# EAGLE design Nixie Test - backup (EAGLE 6.5.0)

## Sheet 1 of 12
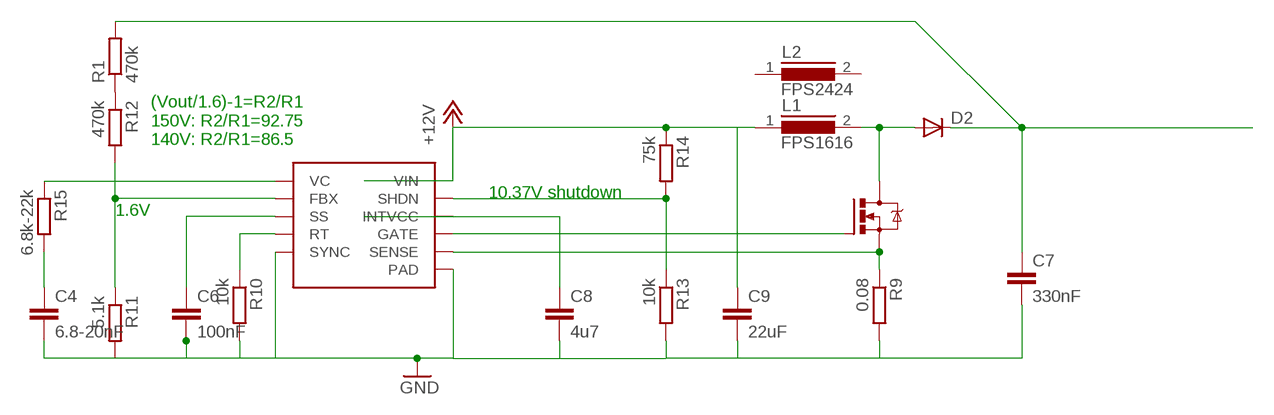
[diagram p0: schematic, sheet 1]

### Parts
C4  6.8-20nF  C-EUC0805K  [C0805K]
C6  100nF  C-EUC0805K  [C0805K]
C7  330nF  C-EUC1812  [C1812]
C8  4u7  C-EUC1206K  [C1206K]
C9  22uF  C-EUC1210K  [C1210K]
D2  DIODE-DO219AB  [DO219AB]
L1  FPS1616  [1616FPS_22UH]
L2  FPS2424  [242408FPS_22UH]
Q1  N-MOSFET-TO252-DPAK  [TO252]
R1  470k  R-EU_R0805  [R0805]
R9  0.08  R-EU_R0805  [R0805]
R10  10k  R-EU_R0805  [R0805]
R11  5.1k  R-EU_R0805  [R0805]
R12  470k  R-EU_R0805  [R0805]
R13  10k  R-EU_R0805  [R0805]
R14  75k  R-EU_R0805  [R0805]
R15  6.8k-22k  R-EU_R0805  [R0805]
U2  LT3757MSOP-10  [MSOP-10]

### Nets
+12V: C9.1 L1.1 R14.1 U2.10(VIN) ; also sheet 2,3,4,5,6,7,8,9,10,11,12
GND: C4.2 C6.2 C7.2 C8.2 C9.2 R9.2 R10.2 R11.2 R13.2 U2.5(SYNC) U2.PAD ; also sheet 2,3,4,5,6,7,8,9,10,11,12
N$1: R1.1 R12.1
N$19: Q1.1(G) U2.7(GATE)
N$20: R11.1 R12.2 U2.2(FBX)
N$21: D2.A L1.2 Q1.3(D)
N$22: C7.1 D2.C R1.2
N$23: C6.1 U2.3(SS)
N$24: R10.1 U2.4(RT)
N$25: Q1.2(S) R9.1 U2.6(SENSE)
N$26: R13.1 R14.2 U2.9(SHDN)
N$27: C4.1 R15.2
N$28: R15.1 U2.1(VC)
N$29: C8.1 U2.8(INTVCC)
Unconnected: L2.1 L2.2

### Notes on the sheet
- (Vout/1.6)-1=R2/R1
  150V: R2/R1=92.75
  140V: R2/R1=86.5
- 10.37V shutdown
- 1.6V

## Sheet 2 of 12
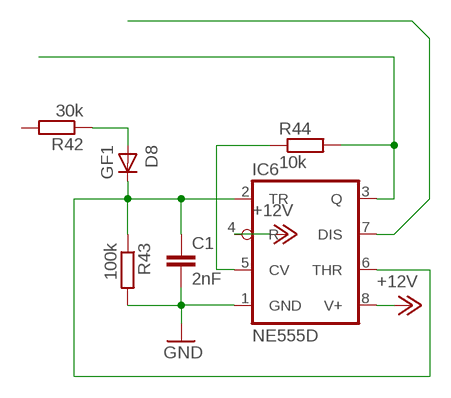
[diagram p1: schematic, sheet 2]

### Parts
C1  2nF  C-EUC1206K  [C1206K]
D8  GF1  [SMA-DO214AC]
IC6  NE555D  [SO08]
R42  30k  R-EU_R0805  [R0805]
R43  100k  R-EU_R0805  [R0805]
R44  10k  R-EU_R0805  [R0805]

### Nets
+12V: IC6.4(R) IC6.8(V+) ; also sheet 1,3,4,5,6,7,8,9,10,11,12
GND: C1.2 IC6.1(GND) R43.2 ; also sheet 1,3,4,5,6,7,8,9,10,11,12
N$2: IC6.7(DIS)
N$84: D8.A R42.1
N$85: IC6.3(Q) R44.2
N$86: IC6.5(CV) R44.1
N$90: C1.1 D8.K(C) IC6.2(TR) IC6.6(THR) R43.1
Unconnected: R42.2

## Sheet 3 of 12
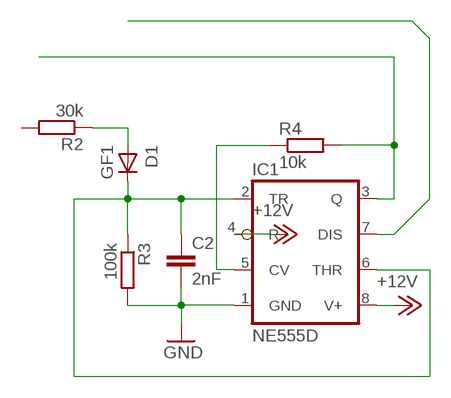
[diagram p2: schematic, sheet 3]

### Parts
C2  2nF  C-EUC1206K  [C1206K]
D1  GF1  [SMA-DO214AC]
IC1  NE555D  [SO08]
R2  30k  R-EU_R0805  [R0805]
R3  100k  R-EU_R0805  [R0805]
R4  10k  R-EU_R0805  [R0805]

### Nets
+12V: IC1.4(R) IC1.8(V+) ; also sheet 1,2,4,5,6,7,8,9,10,11,12
GND: C2.2 IC1.1(GND) R3.2 ; also sheet 1,2,4,5,6,7,8,9,10,11,12
N$10: D1.A R2.1
N$11: IC1.5(CV) R4.1
N$12: C2.1 D1.K(C) IC1.2(TR) IC1.6(THR) R3.1
N$13: IC1.3(Q) R4.2
N$14: IC1.7(DIS)
Unconnected: R2.2

## Sheet 4 of 12
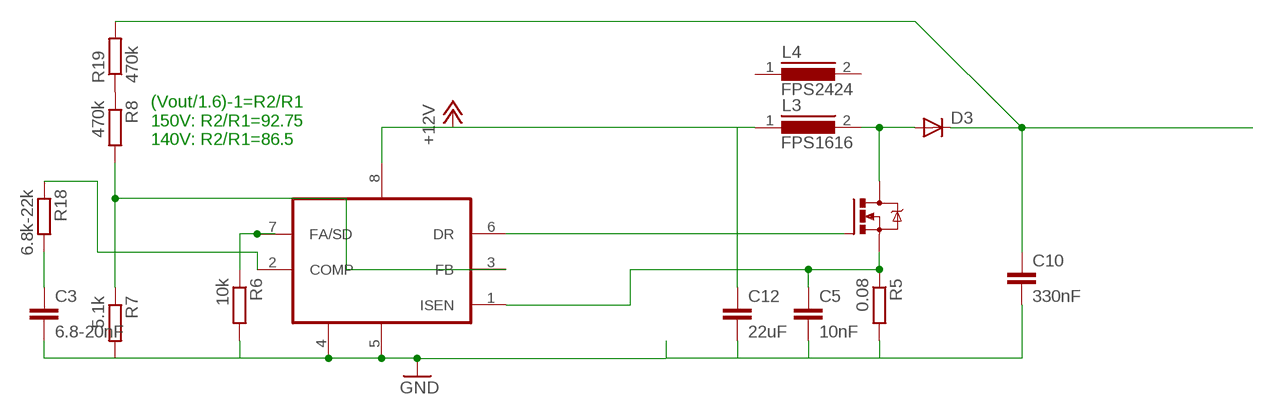
[diagram p3: schematic, sheet 4]

### Parts
C3  6.8-20nF  C-EUC0805K  [C0805K]
C5  10nF  C-EUC0805K  [C0805K]
C10  330nF  C-EUC1812  [C1812]
C12  22uF  C-EUC1210K  [C1210K]
D3  DIODE-DO219AB  [DO219AB]
L3  FPS1616  [1616FPS_22UH]
L4  FPS2424  [242408FPS_22UH]
Q2  N-MOSFET-TO252-DPAK  [TO252]
R5  0.08  R-EU_R0805  [R0805]
R6  10k  R-EU_R0805  [R0805]
R7  5.1k  R-EU_R0805  [R0805]
R8  470k  R-EU_R0805  [R0805]
R18  6.8k-22k  R-EU_R0805  [R0805]
R19  470k  R-EU_R0805  [R0805]
U3  LM3478  [MSOP08]

### Nets
+12V: C12.1 L3.1 U3.8(VIN) ; also sheet 1,2,3,5,6,7,8,9,10,11,12
GND: C3.2 C5.2 C10.2 C12.2 R5.2 R6.2 R7.2 U3.4(AGND) U3.5(PGND) ; also sheet 1,2,3,5,6,7,8,9,10,11,12
N$33: Q2.1(G) U3.6(DR)
N$34: R7.1 R8.2 U3.3(FB)
N$35: D3.A L3.2 Q2.3(D)
N$36: C10.1 D3.C R19.2
N$37: R18.1 U3.2(COMP)
N$38: R6.1 U3.7(FA/SD)
N$39: C5.1 Q2.2(S) R5.1 U3.1(ISEN)
N$41: C3.1 R18.2
N$44: R8.1 R19.1
Unconnected: L4.1 L4.2

### Notes on the sheet
- (Vout/1.6)-1=R2/R1
  150V: R2/R1=92.75
  140V: R2/R1=86.5

## Sheet 5 of 12
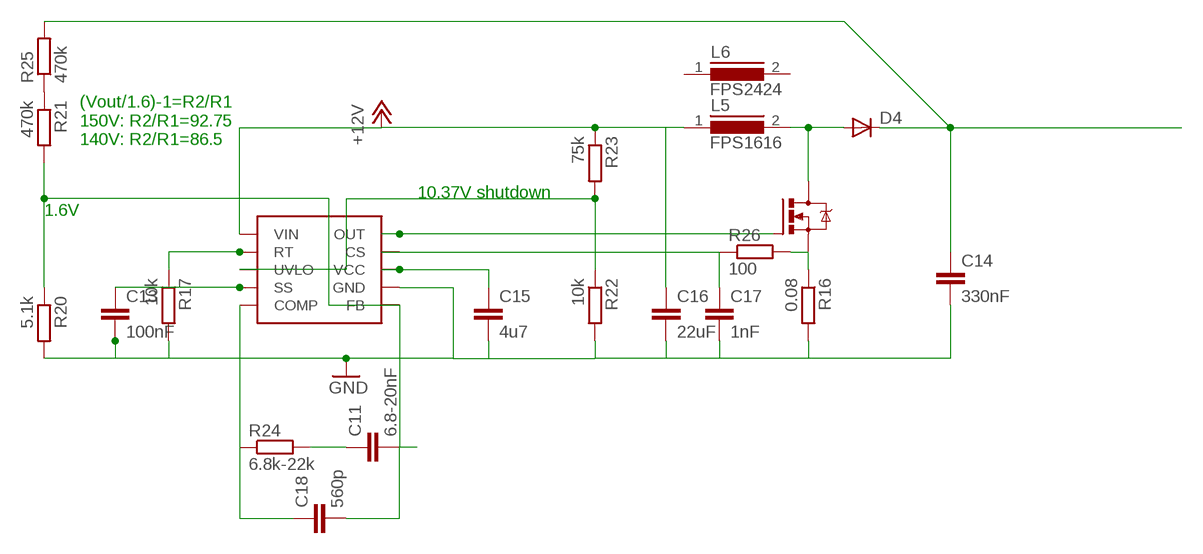
[diagram p4: schematic, sheet 5]

### Parts
C11  6.8-20nF  C-EUC0805K  [C0805K]
C13  100nF  C-EUC0805K  [C0805K]
C14  330nF  C-EUC1812  [C1812]
C15  4u7  C-EUC1206K  [C1206K]
C16  22uF  C-EUC1210K  [C1210K]
C17  1nF  C-EUC0805K  [C0805K]
C18  560p  C-EUC0805K  [C0805K]
D4  DIODE-DO219AB  [DO219AB]
L5  FPS1616  [1616FPS_22UH]
L6  FPS2424  [242408FPS_22UH]
Q3  N-MOSFET-TO252-DPAK  [TO252]
R16  0.08  R-EU_R0805  [R0805]
R17  10k  R-EU_R0805  [R0805]
R20  5.1k  R-EU_R0805  [R0805]
R21  470k  R-EU_R0805  [R0805]
R22  10k  R-EU_R0805  [R0805]
R23  75k  R-EU_R0805  [R0805]
R24  6.8k-22k  R-EU_R0805  [R0805]
R25  470k  R-EU_R0805  [R0805]
R26  100  R-EU_R0805  [R0805]
U4  LM5022MSOP-10  [MSOP-10-NOPAD]

### Nets
+12V: C16.1 L5.1 R23.1 U4.1(VIN) ; also sheet 1,2,3,4,6,7,8,9,10,11,12
GND: C13.2 C14.2 C15.2 C16.2 C17.2 R16.2 R17.2 R20.2 R22.2 U4.6(GND) ; also sheet 1,2,3,4,6,7,8,9,10,11,12
N$42: Q3.1(G) U4.5(OUT)
N$43: C11.2 C18.2 R20.1 R21.2 U4.2(FB)
N$45: D4.A L5.2 Q3.3(D)
N$46: C14.1 D4.C R25.2
N$47: C13.1 U4.10(SS)
N$48: R17.1 U4.9(RT)
N$49: Q3.2(S) R16.1 R26.2
N$50: R22.1 R23.2 U4.7(UVLO)
N$51: C11.1 R24.2
N$52: C18.1 R24.1 U4.3(COMP)
N$53: C15.1 U4.4(VCC)
N$54: R21.1 R25.1
N$55: C17.1 R26.1 U4.8(CS)
Unconnected: L6.1 L6.2

### Notes on the sheet
- (Vout/1.6)-1=R2/R1
  150V: R2/R1=92.75
  140V: R2/R1=86.5
- 10.37V shutdown
- 1.6V

## Sheet 6 of 12
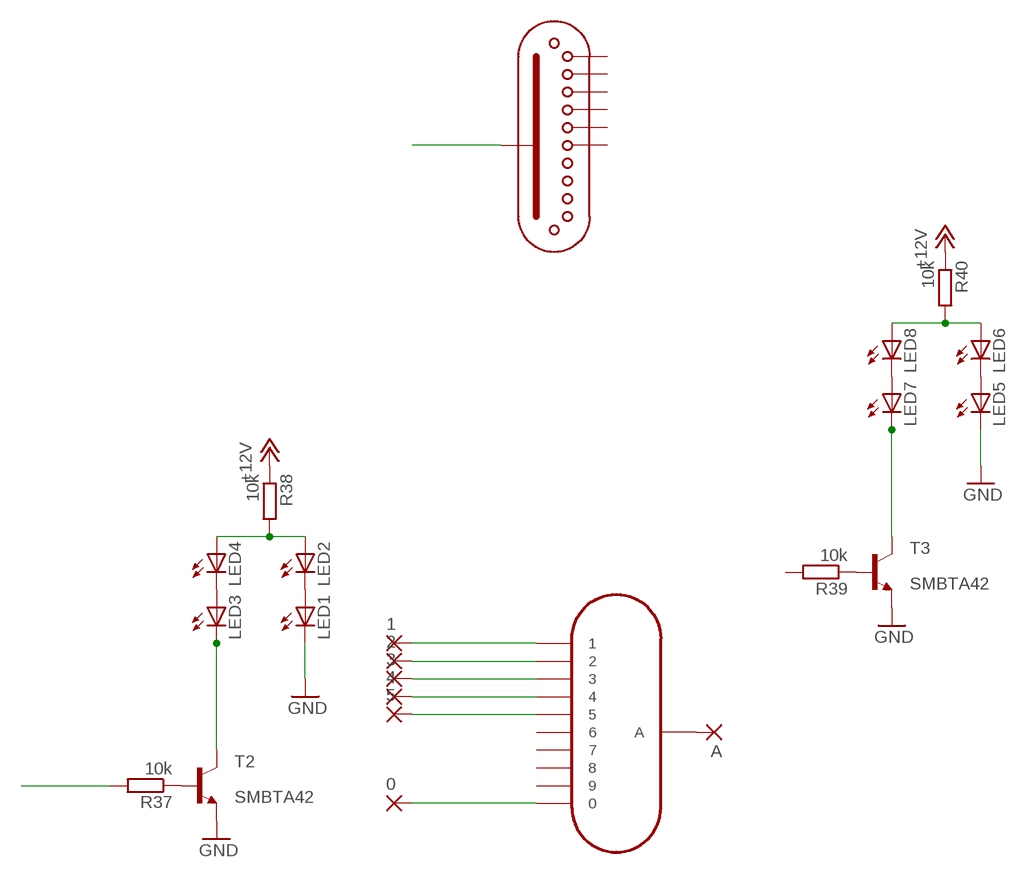
[diagram p5: schematic, sheet 6]

### Parts
0  SMD2  [SMD1,27-2,54]
1  SMD2  [SMD1,27-2,54]
2  SMD2  [SMD1,27-2,54]
3  SMD2  [SMD1,27-2,54]
4  SMD2  [SMD1,27-2,54]
5  SMD2  [SMD1,27-2,54]
A  SMD2  [SMD1,27-2,54]
LED1  LED3MM  [LED3MM]
LED2  LED3MM  [LED3MM]
LED3  LED3MM  [LED3MM]
LED4  LED3MM  [LED3MM]
LED5  LED3MM  [LED3MM]
LED6  LED3MM  [LED3MM]
LED7  LED3MM  [LED3MM]
LED8  LED3MM  [LED3MM]
N1  IN-12A-IN-12  [IN-12]
R37  10k  R-EU_R0805  [R0805]
R38  10k  R-EU_R0805  [R0805]
R39  10k  R-EU_R0805  [R0805]
R40  10k  R-EU_R0805  [R0805]
T2  MMBTA42LT1-NPN-SOT23-BEC  [SOT23-BEC]
T3  MMBTA42LT1-NPN-SOT23-BEC  [SOT23-BEC]
U$3  ZM1020  [ZM1020]

### Nets
+12V: R38.1 R40.1 ; also sheet 1,2,3,4,5,7,8,9,10,11,12
GND: LED1.K(C) LED5.K(C) T2.E T3.E ; also sheet 1,2,3,4,5,7,8,9,10,11,12
N$60: R37.2
N$91: LED1.A LED2.K(C)
N$92: LED3.A LED4.K(C)
N$93: R37.1 T2.B
N$94: LED3.K(C) T2.C
N$95: LED2.A LED4.A R38.2
N$96: U$3.12(A)
N$97: 0.1(P) N1.0
N$98: 1.1(P) N1.1
N$99: 2.1(P) N1.2
N$100: 3.1(P) N1.3
N$101: 4.1(P) N1.4
N$102: 5.1(P) N1.5
N$103: A.1(P) N1.A
N$104: LED5.A LED6.K(C)
N$105: LED7.A LED8.K(C)
N$106: R39.1 T3.B
N$107: LED7.K(C) T3.C
N$108: LED6.A LED8.A R40.2
Unconnected: N1.6 N1.7 N1.8 N1.9 R39.2 U$3.1 U$3.2 U$3.3 U$3.4 U$3.5 U$3.11

## Sheet 7 of 12
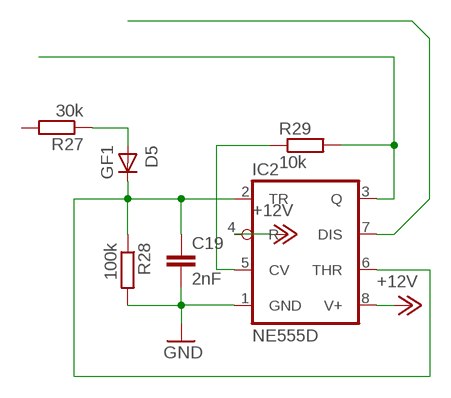
[diagram p6: schematic, sheet 7]

### Parts
C19  2nF  C-EUC1206K  [C1206K]
D5  GF1  [SMA-DO214AC]
IC2  NE555D  [SO08]
R27  30k  R-EU_R0805  [R0805]
R28  100k  R-EU_R0805  [R0805]
R29  10k  R-EU_R0805  [R0805]

### Nets
+12V: IC2.4(R) IC2.8(V+) ; also sheet 1,2,3,4,5,6,8,9,10,11,12
GND: C19.2 IC2.1(GND) R28.2 ; also sheet 1,2,3,4,5,6,8,9,10,11,12
N$58: D5.A R27.1
N$59: IC2.5(CV) R29.1
N$61: C19.1 D5.K(C) IC2.2(TR) IC2.6(THR) R28.1
N$62: IC2.3(Q) R29.2
N$63: IC2.7(DIS)
Unconnected: R27.2

## Sheet 8 of 12
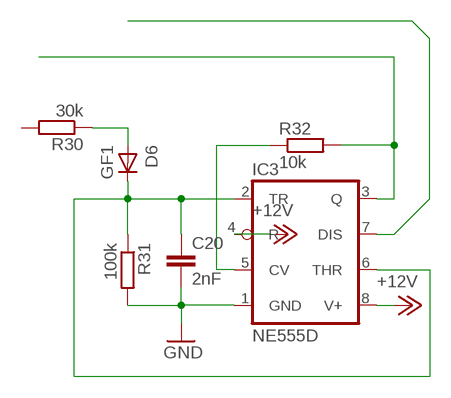
[diagram p7: schematic, sheet 8]

### Parts
C20  2nF  C-EUC1206K  [C1206K]
D6  GF1  [SMA-DO214AC]
IC3  NE555D  [SO08]
R30  30k  R-EU_R0805  [R0805]
R31  100k  R-EU_R0805  [R0805]
R32  10k  R-EU_R0805  [R0805]

### Nets
+12V: IC3.4(R) IC3.8(V+) ; also sheet 1,2,3,4,5,6,7,9,10,11,12
GND: C20.2 IC3.1(GND) R31.2 ; also sheet 1,2,3,4,5,6,7,9,10,11,12
N$71: D6.A R30.1
N$72: IC3.5(CV) R32.1
N$73: C20.1 D6.K(C) IC3.2(TR) IC3.6(THR) R31.1
N$75: IC3.3(Q) R32.2
N$76: IC3.7(DIS)
Unconnected: R30.2

## Sheet 9 of 12
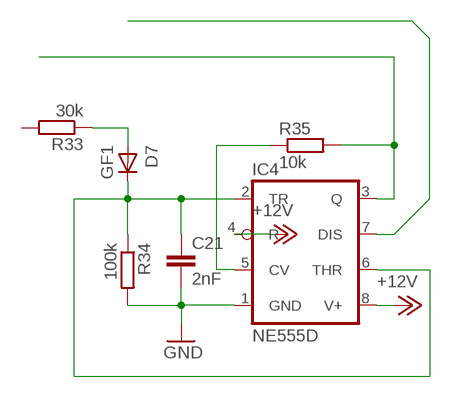
[diagram p8: schematic, sheet 9]

### Parts
C21  2nF  C-EUC1206K  [C1206K]
D7  GF1  [SMA-DO214AC]
IC4  NE555D  [SO08]
R33  30k  R-EU_R0805  [R0805]
R34  100k  R-EU_R0805  [R0805]
R35  10k  R-EU_R0805  [R0805]

### Nets
+12V: IC4.4(R) IC4.8(V+) ; also sheet 1,2,3,4,5,6,7,8,10,11,12
GND: C21.2 IC4.1(GND) R34.2 ; also sheet 1,2,3,4,5,6,7,8,10,11,12
N$87: D7.A R33.1
N$88: IC4.5(CV) R35.1
N$89: C21.1 D7.K(C) IC4.2(TR) IC4.6(THR) R34.1
N$123: IC4.3(Q) R35.2
N$124: IC4.7(DIS)
Unconnected: R33.2

## Sheet 10 of 12
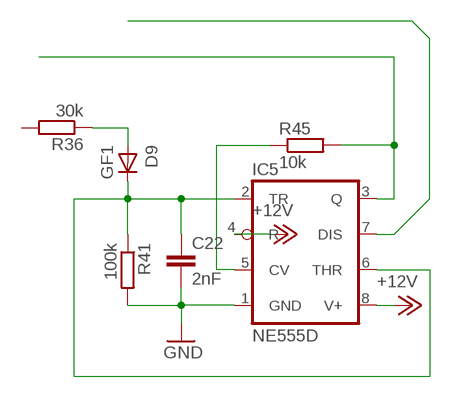
[diagram p9: schematic, sheet 10]

### Parts
C22  2nF  C-EUC1206K  [C1206K]
D9  GF1  [SMA-DO214AC]
IC5  NE555D  [SO08]
R36  30k  R-EU_R0805  [R0805]
R41  100k  R-EU_R0805  [R0805]
R45  10k  R-EU_R0805  [R0805]

### Nets
+12V: IC5.4(R) IC5.8(V+) ; also sheet 1,2,3,4,5,6,7,8,9,11,12
GND: C22.2 IC5.1(GND) R41.2 ; also sheet 1,2,3,4,5,6,7,8,9,11,12
N$132: D9.A R36.1
N$133: IC5.5(CV) R45.1
N$134: C22.1 D9.K(C) IC5.2(TR) IC5.6(THR) R41.1
N$135: IC5.3(Q) R45.2
N$136: IC5.7(DIS)
Unconnected: R36.2

## Sheet 11 of 12
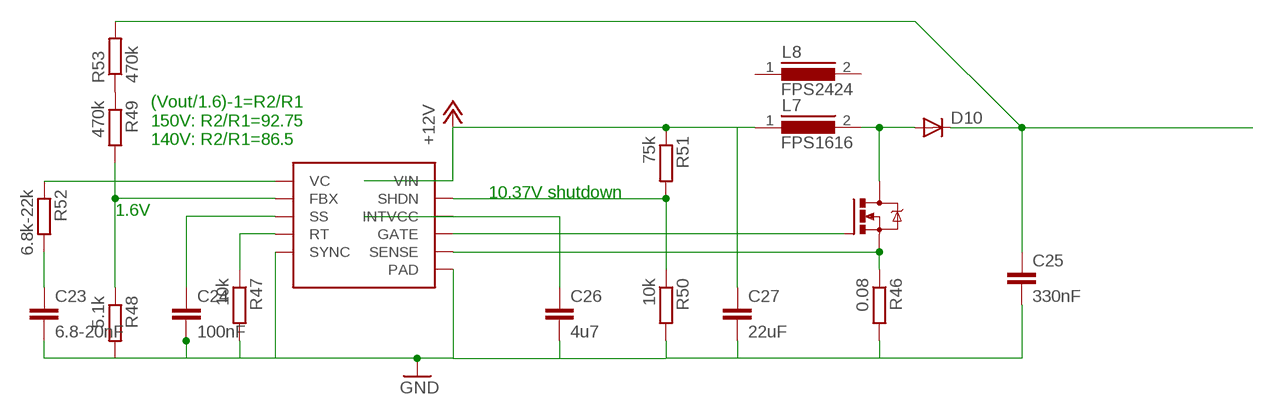
[diagram p10: schematic, sheet 11]

### Parts
C23  6.8-20nF  C-EUC0805K  [C0805K]
C24  100nF  C-EUC0805K  [C0805K]
C25  330nF  C-EUC1812  [C1812]
C26  4u7  C-EUC1206K  [C1206K]
C27  22uF  C-EUC1210K  [C1210K]
D10  DIODE-DO219AB  [DO219AB]
L7  FPS1616  [1616FPS_22UH]
L8  FPS2424  [242408FPS_22UH]
Q4  N-MOSFET-TO252-DPAK  [TO252]
R46  0.08  R-EU_R0805  [R0805]
R47  10k  R-EU_R0805  [R0805]
R48  5.1k  R-EU_R0805  [R0805]
R49  470k  R-EU_R0805  [R0805]
R50  10k  R-EU_R0805  [R0805]
R51  75k  R-EU_R0805  [R0805]
R52  6.8k-22k  R-EU_R0805  [R0805]
R53  470k  R-EU_R0805  [R0805]
U1  LT3757MSOP-10  [MSOP-10]

### Nets
+12V: C27.1 L7.1 R51.1 U1.10(VIN) ; also sheet 1,2,3,4,5,6,7,8,9,10,12
GND: C23.2 C24.2 C25.2 C26.2 C27.2 R46.2 R47.2 R48.2 R50.2 U1.5(SYNC) U1.PAD ; also sheet 1,2,3,4,5,6,7,8,9,10,12
N$144: Q4.1(G) U1.7(GATE)
N$145: R48.1 R49.2 U1.2(FBX)
N$146: D10.A L7.2 Q4.3(D)
N$147: C25.1 D10.C R53.2
N$148: C24.1 U1.3(SS)
N$149: R47.1 U1.4(RT)
N$150: Q4.2(S) R46.1 U1.6(SENSE)
N$151: R50.1 R51.2 U1.9(SHDN)
N$152: C23.1 R52.2
N$153: R52.1 U1.1(VC)
N$154: C26.1 U1.8(INTVCC)
N$155: R49.1 R53.1
Unconnected: L8.1 L8.2

### Notes on the sheet
- (Vout/1.6)-1=R2/R1
  150V: R2/R1=92.75
  140V: R2/R1=86.5
- 10.37V shutdown
- 1.6V

## Sheet 12 of 12
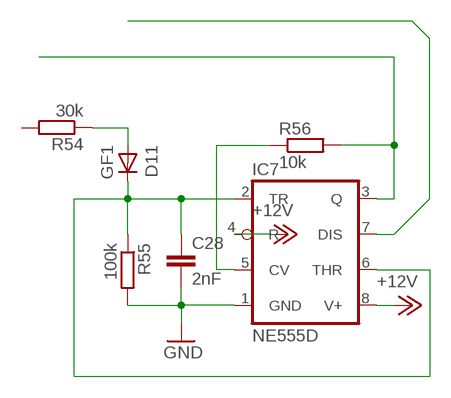
[diagram p11: schematic, sheet 12]

### Parts
C28  2nF  C-EUC1206K  [C1206K]
D11  GF1  [SMA-DO214AC]
IC7  NE555D  [SO08]
R54  30k  R-EU_R0805  [R0805]
R55  100k  R-EU_R0805  [R0805]
R56  10k  R-EU_R0805  [R0805]

### Nets
+12V: IC7.4(R) IC7.8(V+) ; also sheet 1,2,3,4,5,6,7,8,9,10,11
GND: C28.2 IC7.1(GND) R55.2 ; also sheet 1,2,3,4,5,6,7,8,9,10,11
N$159: D11.A R54.1
N$160: IC7.5(CV) R56.1
N$161: C28.1 D11.K(C) IC7.2(TR) IC7.6(THR) R55.1
N$162: IC7.3(Q) R56.2
N$163: IC7.7(DIS)
Unconnected: R54.2

## Library data of the parts
0 1-5 A = wirepad:SMD2: SMD PAD
C1-C28 = rcl:C-EU: CAPACITOR, European symbol
D1 D5-D9 D11 = diode:GF1: DIODE
D2-D4 D10 = diode_extended:DIODE-: DIODE
IC1-IC7 = linear:*555: TIMER
L1-L8 = inductor_power:FPS: High Power Density, High Efficiency, Shielded Inductors Source: coiltronics_dr_series.pdf
LED1-LED8 = led:LED: LED OSRAM: - CHIPLED LG R971, LG N971, LY N971, LG Q971, LY Q971, LO R971, LY R971 LH N974, LH R974 LS Q976, LO Q976, LY Q976 LO Q996 - Hyper CHIPLED LW Q18S LB Q993, LB Q99A, LB R99A - SideLED LS A670, LO A670, LY A670, LG A670, LP A670 LB A673, LV A673, LT A673, LW A673 LH A674 LY A675 LS A676, LA A676, LO A676, LY A676, LW A676 LS A679, LY A679, LG A679 - Hyper Micro SIDELED® LS Y876, LA Y876, LO Y876, LY Y876 LT Y87S - SmartLED LW L88C, LW L88S LB L89C, LB L89S, LG L890 LS L89K, LO L89K, LY L89K LS L896, LA L896, LO L896, LY L896 - TOPLED LS T670, LO T670, LY T670, LG T670, LP T670 LSG T670, LSP T670, LSY T670, LOP T670, LYG T670 LG T671, LOG T671, LSG T671 LB T673, LV T673, LT T673, LW T673 LH T674 LS T676, LA T676, LO T676, LY T676, LB T676, LH T676, LSB T676, LW T676 LB T67C, LV T67C, LT T67C, LS T67K, LO T67K, LY T67K, LW E67C LS E67B, LA E67B, LO E67B, LY E67B, LB E67C, LV E67C, LT E67C LW T67C LS T679, LY T679, LG T679 LS T770, LO T770, LY T770, LG T770, LP T770 LB T773, LV T773, LT T773, LW T773 LH T774 LS E675, LA E675, LY E675, LS T675 LS T776, LA T776, LO T776, LY T776, LB T776 LHGB T686 LT T68C, LB T68C - Hyper Mini TOPLED® LB M676 - Mini TOPLED Santana® LG M470 LS M47K, LO M47K, LY M47K Source: http://www.osram.convergy.de LUXEON: - LUMILED® LXK2-PW12-R00, LXK2-PW12-S00, LXK2-PW14-U00, LXK2-PW14-V00 LXK2-PM12-R00, LXK2-PM12-S00, LXK2-PM14-U00 LXK2-PE12-Q00, LXK2-PE12-R00, LXK2-PE12-S00, LXK2-PE14-T00, LXK2-PE14-U00 LXK2-PB12-K00, LXK2-PB12-L00, LXK2-PB12-M00, LXK2-PB14-N00, LXK2-PB14-P00, LXK2-PB14-Q00 LXK2-PR12-L00, LXK2-PR12-M00, LXK2-PR14-Q00, LXK2-PR14-R00 LXK2-PD12-Q00, LXK2-PD12-R00, LXK2-PD12-S00 LXK2-PH12-R00, LXK2-PH12-S00 LXK2-PL12-P00, LXK2-PL12-Q00, LXK2-PL12-R00 Source: www.luxeon.com KINGBRIGHT: KA-3528ASYC Source: www.kingbright.com
N1 = IN-12A:IN-12A
Q1-Q4 = N-MOSFET:N-MOSFET
R1-R56 = rcl:R-EU_: RESISTOR, European symbol
T2 T3 = transistor:*-NPN-: NPN Transistror BF959 corrected 2008.03.06; T: SMBTA42
U1 U2 = LT3757:LT3757
U3 = LM3478:LM3478
U4 = LM5022:LM5022
U$3 = ZM1020:ZM1020

## Board
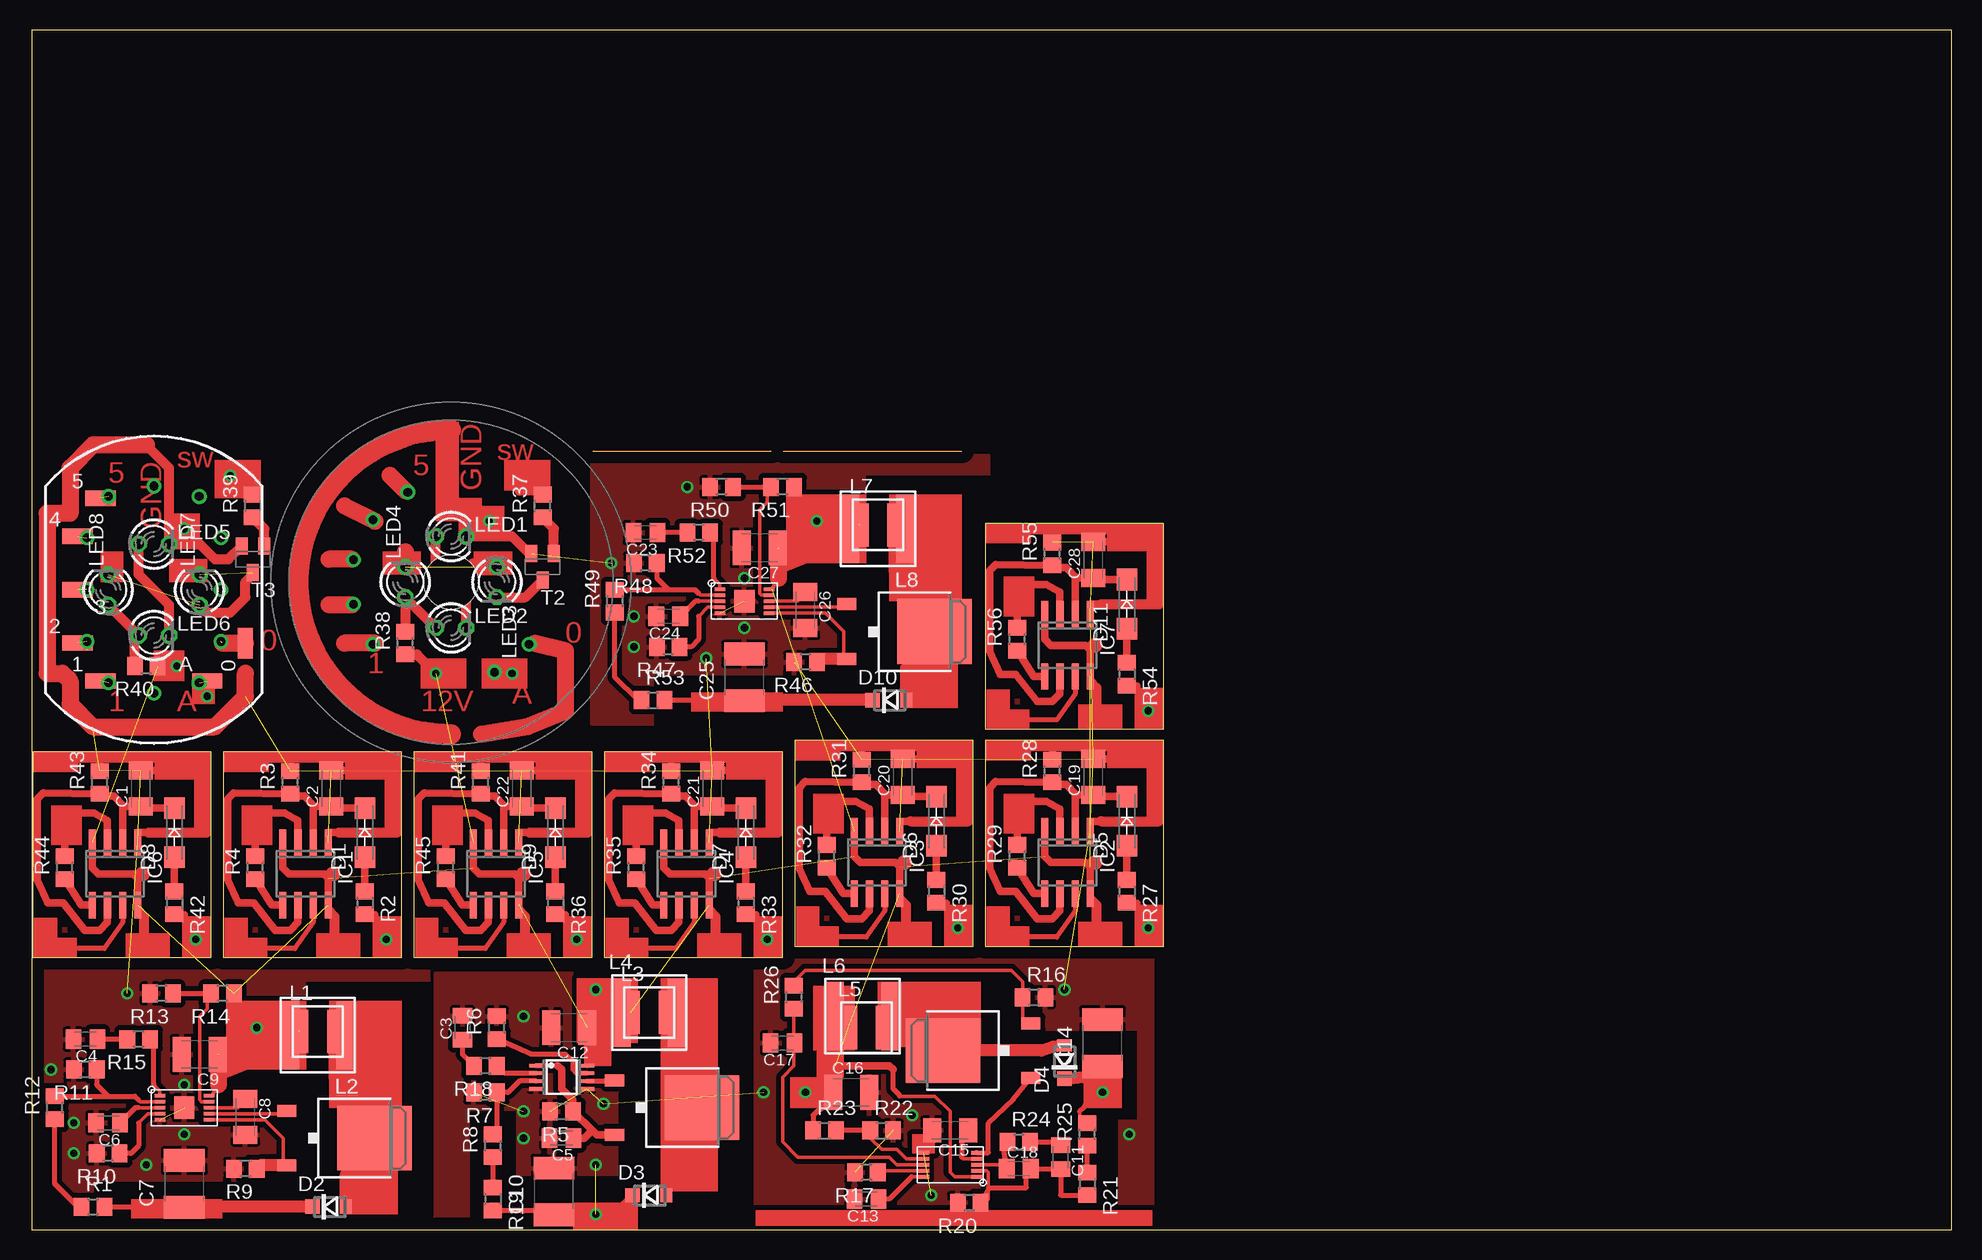
[diagram p12: board, top side]

Size 160 x 100 mm. Coordinates in mm from the lower left corner, seen from the top.
Outline: 46.74,64.9 61.59,64.9
Outline: 62.61,64.9 77.47,64.9
Outline: 0,0 160,0 160,100 0,100 0,0
Outline: 14.92,39.81 0.06,39.81 0.06,22.67 14.92,22.67 14.92,39.81
Outline: 30.8,39.81 15.94,39.81 15.94,22.67 30.8,22.67 30.8,39.81
Outline: 94.3,40.77 79.44,40.77 79.44,23.62 94.3,23.62 94.3,40.77
Outline: 78.42,40.77 63.56,40.77 63.56,23.62 78.42,23.62 78.42,40.77
Outline: 62.55,39.81 47.69,39.81 47.69,22.67 62.55,22.67 62.55,39.81
Outline: 46.67,39.81 31.81,39.81 31.81,22.67 46.67,22.67 46.67,39.81
Outline: 94.3,58.86 79.44,58.86 79.44,41.72 94.3,41.72 94.3,58.86
Copper layers (1*16): Top 0.035mm / dielectric 1.5mm / Bottom 0.035mm
Design rules "default *": minimum track width 10mil, minimum drill 24mil, track to track 16mil, track to pad 8mil, pad to pad 8mil, via to via 8mil, smd to smd 8mil, copper to edge 40mil, drill to drill 8mil, minimum pad ring 10mil, minimum via ring 8mil, stop-mask expansion 4mil, vias tented up to drill 0mil, thermal gap 10mil
tRestrict: area 5.4,-0.3 to 32.7,12.4; area 22.9,12.1 to 33,20.6; area 36.8,14.6 to 37.8,17.1; area 48.9,0 to 59.4,21.6; area 36.5,-0.3 to 40.3,9.8; area 40.3,2.2 to 49.5,4.4; area 79.4,1.6 to 90.5,16.5; area 89.9,10.5 to 92.1,16.5; area 90.5,9.2 to 92.1,10.5; area 67.9,8.9 to 69.2,13; area 52.1,41.9 to 79.4,54.6; area 69.5,54.3 to 79.7,62.9

### Footprints (pad centres in the part's own frame; a part is rotated, then mirrored left to right if it is on the bottom)
SMD1,27-2,54 = smd 1.27 x 2.54: 1 0,0
C1206K = smd 1.5 x 2: 1 -1.5,0; 2 1.5,0
C0805K = smd 1.3 x 1.6: 1 -1,0; 2 1,0
C1812 = smd 1.9 x 3.4: 1 -1.95,0; 2 1.95,0
C1210K = smd 1.5 x 2.9: 1 -1.5,0; 2 1.5,0
SMA-DO214AC = smd 1.8 x 1.7: A -2.05,0; K 2.05,0
DO219AB = smd 1 x 1.2: A 1.4,0 | smd 1.2 x 1.2: C -1.4,0
SO08 = smd 0.6 x 2.2: 1 -1.905,-2.6; 2 -0.635,-2.6; 3 0.635,-2.6; 4 1.905,-2.6; 5 1.905,2.6; 6 0.635,2.6; 7 -0.635,2.6; 8 -1.905,2.6
1616FPS_22UH = smd 1.5 x 3.6: 1 -1.525,0; 2 1.525,0
242408FPS_22UH = smd 1.6 x 5.7: 1 -2.35,0; 2 2.35,0
LED3MM = drill 0.813 octagon: A -1.27,0; K 1.27,0
IN-12 = drill 0.711: 0 5.59,-4.32; 1 -3.78,-7.766; 2 -5.59,-4.32; 3 -5.59,0; 4 -5.59,4.32; 5 -3.78,7.766; 6 0,8.64; 7 3.78,7.766; 8 5.59,4.32; 9 5.59,0; LHDP 0,-8.64 | drill 0.711 octagon: A 3.78,-7.766
TO252 = smd 1 x 1.6: 1 -2.28,-4.8; 2 2.28,-4.8 | smd 5.4 x 6.2: 3 0,2.5
R0805 = smd 1.3 x 1.5: 1 -0.95,0; 2 0.95,0
SOT23-BEC = smd 1 x 1.4: B -0.95,-1.1; C 0,1.1; E 0.95,-1.1
MSOP-10 = smd 0.305 x 0.889: 1 -1,-2.045; 2 -0.5,-2.045; 3 0,-2.045; 4 0.5,-2.045; 5 1,-2.045; 6 1,2.045; 7 0.5,2.045; 8 0,2.045; 9 -0.5,2.045; 10 -1,2.045 | smd 1.88 x 1.68: PAD 0,0
MSOP08 = smd 0.3 x 1.2: 1 -0.976,-2.113; 2 -0.326,-2.113; 3 0.324,-2.113; 4 0.974,-2.113; 5 0.974,2.112; 6 0.324,2.112; 7 -0.326,2.112; 8 -0.976,2.112
MSOP-10-NOPAD = smd 0.305 x 0.889: 1 -1,-2.209; 2 -0.5,-2.209; 3 0,-2.209; 4 0.5,-2.209; 5 1,-2.209; 6 1,2.209; 7 0.5,2.209; 8 0,2.209; 9 -0.5,2.209; 10 -1,2.209
ZM1020 = drill 0.711: 1 -6.51,-5.19; 2 -8.12,-1.85; 3 -8.12,1.85; 4 -6.51,5.19; 5 -3.61,7.5; 11 6.51,-5.19; 12 3.61,-7.5 | hole 4.5: 0,0

### Placement (x,y rotation side)
0  17.78,48.9 0 top
1  5.71,45.72 270 top
2  3.81,48.9 270 top
3  3.81,53.34 90 top
4  3.81,57.78 270 top
5  5.71,60.96 270 top
A  14.61,45.72 270 top
C1  9.08,36.77 90 top
C2  24.96,36.77 90 top
C3  35.88,16.83 90 top
C4  4.45,15.88 180 top
C5  44.13,7.62 180 top
C6  6.35,8.89 180 top
C7  12.7,3.81 90 top
C8  17.78,9.4 270 top
C9  13.97,14.61 180 top
C10  43.5,3.17 90 top
C11  85.72,6.03 270 top
C12  44.77,16.83 180 top
C13  69.53,2.54 180 top
C14  89.22,15.56 90 top
C15  76.52,8.26 180 top
C16  68.26,11.43 0 top
C17  62.55,15.56 180 top
C18  82.23,5.08 0 top
C19  88.46,37.72 90 top
C20  72.58,37.72 90 top
C21  56.71,36.77 90 top
C22  40.83,36.77 90 top
C23  51.12,58.1 180 top
C24  53.02,51.12 180 top
C25  59.37,46.04 90 top
C26  64.45,51.63 270 top
C27  60.64,56.83 180 top
C28  88.46,55.82 90 top
D1  27.75,33.08 90 top
D2  24.77,1.91 0 top
D3  51.44,2.86 0 top
D4  86.04,13.97 90 top
D5  91.25,34.04 90 top
D6  75.37,34.04 90 top
D7  59.5,33.08 90 top
D8  11.87,33.08 90 top
D9  43.62,33.08 90 top
D10  71.44,44.13 0 top
D11  91.25,52.13 90 top
IC1  22.8,29.65 180 top
IC2  86.3,30.61 180 top
IC3  70.42,30.61 180 top
IC4  54.55,29.65 180 top
IC5  38.67,29.65 180 top
IC6  6.92,29.65 180 top
IC7  86.3,48.7 180 top
L1  23.81,16.51 0 top
L2  23.81,16.19 180 top
L3  51.44,18.1 0 top
L4  51.44,18.1 0 top
L5  69.53,16.83 0 top
L6  69.22,17.78 0 top
L7  70.48,58.74 0 top
L8  70.48,58.42 180 top
LED1  34.92,57.78 0 top
LED2  34.92,50.16 0 top
LED3  38.73,53.98 270 top
LED4  31.11,53.98 90 top
LED5  10.16,57.15 0 top
LED6  10.16,49.53 0 top
LED7  13.97,53.34 90 top
LED8  6.35,53.34 90 top
N1  10.16,53.34 0 top
Q1  26.04,7.62 270 top
Q2  53.34,10.16 270 top
Q3  78.42,14.92 90 top
Q4  72.71,49.85 270 top
R1  5.08,1.91 0 top
R2  27.75,27.24 270 top
R3  21.53,37.27 90 top
R4  18.61,30.16 90 top
R5  44.13,9.84 180 top
R6  38.73,16.83 90 top
R7  37.78,11.43 180 top
R8  38.42,6.99 90 top
R9  17.78,5.08 180 top
R10  6.35,6.35 180 top
R11  4.45,13.34 180 top
R12  1.91,10.16 90 top
R13  10.79,19.68 180 top
R14  15.88,19.68 180 top
R15  8.89,15.88 180 top
R16  83.5,19.37 0 top
R17  69.53,4.76 180 top
R18  37.78,13.65 180 top
R19  38.42,2.54 270 top
R20  78.11,2.22 180 top
R21  87.95,3.81 270 top
R22  70.8,8.26 0 top
R23  66.04,8.26 0 top
R24  82.23,7.3 0 top
R25  87.95,7.94 90 top
R26  63.5,19.37 90 top
R27  91.25,28.19 270 top
R28  85.03,38.23 90 top
R29  82.11,31.11 90 top
R30  75.37,28.19 270 top
R31  69.15,38.23 90 top
R32  66.23,31.11 90 top
R33  59.5,27.24 270 top
R34  53.28,37.27 90 top
R35  50.36,30.16 90 top
R36  43.62,27.24 270 top
R37  42.55,60.33 90 top
R38  31.11,48.9 90 top
R39  18.41,60.33 90 top
R40  9.53,46.99 180 top
R41  37.4,37.27 90 top
R42  11.87,27.24 270 top
R43  5.65,37.27 90 top
R44  2.73,30.16 90 top
R45  34.48,30.16 90 top
R46  64.45,47.31 180 top
R47  53.02,48.58 180 top
R48  51.12,55.56 180 top
R49  48.58,52.39 90 top
R50  57.47,61.91 180 top
R51  62.55,61.91 180 top
R52  55.56,58.1 180 top
R53  51.75,44.13 0 top
R54  91.25,46.29 270 top
R55  85.03,56.32 90 top
R56  82.11,49.21 90 top
T2  42.55,55.24 180 top
T3  18.41,55.88 180 top
U1  59.37,52.39 270 top
U2  12.7,10.16 270 top
U3  44.13,12.7 270 top
U4  76.52,5.4 90 top
U$3  34.92,53.98 0 top

### Tracks (layer width: path | path; a pad name or v marks a point on that pad's centre or on a via)
+12V  (via drill 0.6)  (17 unrouted)
  Top 0.305: U2.10 14.97,11.16 15.56,12.06 | U4.1 76.88,4.4 76.52,4.76 76.52,9.84 75.25,11.11 72.3,11.11 | 65.09,8.57 R23.1 | U1.10 61.64,53.39 62.23,54.29
  Top 0.406: R14.1 16.84,16.83 15.71,13.2 | L3.1 49.91,17.84 48.58,16.51 46.59,16.51 C12.1 46.24,16.8 U3.8 | 65.72,10.16 65.09,9.53 65.09,8.57 | 72.3,11.11 72.3,11.2 71.75,11.75 71.75,13.34 | R51.1 63.51,59.05 62.38,55.43
  Top 0.61: IC6.4 5.02,30.16 5.52,29.65 8.45,29.65 8.83,29.27 IC6.8 | IC1.4 20.89,30.16 21.4,29.65 24.32,29.65 24.7,29.27 IC1.8 | 71.75,13.34 71.44,13.65 66.99,13.65 66.99,11.66 C16.1 65.72,10.39 65.72,10.16 | IC2.4 84.39,31.11 84.9,30.61 87.82,30.61 88.2,30.23 IC2.8 | IC3.4 68.52,31.11 69.03,30.61 71.94,30.61 72.33,30.23 IC3.8 | IC4.4 52.64,30.16 53.15,29.65 56.07,29.65 56.45,29.27 IC4.8 | IC5.4 36.77,30.16 37.27,29.65 40.2,29.65 40.58,29.27 IC5.8 | IC7.4 84.39,49.21 84.9,48.7 87.82,48.7 88.2,48.32 IC7.8
  Top 0.813: R38.1 32.06,47.95 v33.66,46.35
  Top 1.422: 15.56,12.06 15.56,14.61 15.71,13.2 18.41,14.29 20,16.51 22.23,16.51 | 62.23,54.29 62.23,56.83 62.38,55.43 65.09,56.52 66.67,58.74 68.9,58.74
GND  (via drill 0.6)  (34 unrouted)
  Top 0.406: U4.6 74.31,7.54 C15.2
  Top 0.813: T2.E 41.45,56.34 40.01,57.78 LED1.K | T3.E 16.36,55.88 15.24,55.88 13.97,57.15 LED5.K 11.43,63.5 9.53,65.41
  Top 1.422: 9.53,65.41 5.08,65.41 3.17,63.5 3.17,59.69 1.27,59.69 1.27,46.35 2.54,46.35 3.17,45.72 3.17,43.81 5.08,41.91 15.24,41.91 17.78,44.45 17.78,46.35
  other vias: 3.49,6.35 3.49,8.89 1.59,13.34 7.94,19.68 12.7,7.94 12.7,12.06 40.96,17.78 40.96,9.84 40.96,7.62 47.62,10.48 9.53,5.4 46.99,5.4 46.99,1.27 86.04,20 91.44,7.94 60.96,11.43 73.34,9.53 74.93,2.86 50.16,48.58 50.16,51.12 48.26,55.56 54.61,61.91 59.37,50.16 59.37,54.29 56.2,47.62
  pour Top: 0,0 33.02,0 33.02,22.23 0,22.23
  pour Top: 33.66,0 59.37,0 59.37,21.27 33.66,21.27
  pour Top: 60.33,-0.32 93.34,-0.32 93.34,23.5 60.33,23.5
  pour Top: 46.67,42.23 79.69,42.23 79.69,64.45 46.67,64.45
N$1
  Top 0.406: R1.1 3.81,1.91 1.91,3.81 R12.1
N$2
  Top 0.406: IC6.7 7.56,25.59 6.03,23.43 3.62,23.43
N$3
  Top 0.406: 8.83,32.32 8.83,33.08
  Top 0.61: 8.83,33.08 9.72,33.08
  Top 0.813: 9.72,33.08 14.54,33.08
N$4
  Top 0.813: 8.95,26.48 9.34,26.1 9.34,24.32
N$5  (via drill 0.6 pad 0.61)
  other vias: 13.65,24.19
N$6
  Top 0.406: 12,26.35 12.76,26.35 12.76,25.84
N$7
  Top 0.61: 5.65,38.16 5.65,39.31
N$8  (via drill 0.6)
  other vias: 18.73,16.83
N$9
  Top 0.61: 9.34,38.29 10.6,38.29
N$10
  Top 0.61: R2.1 D1.A
N$11
  Top 0.61: R4.1 20,27.05 IC1.5
N$12
  Top 0.61: 27.98,35.13 D1.K 24.96,35.13 C2.1 | IC1.6 22.16,25.59 21.53,24.96 20.26,24.96 18.48,27.24 17.21,27.24 16.32,29.15 16.32,35.88 16.83,36.39 R3.1 21.72,36.13 22.67,36.13 23.54,35.27 C2.1 | C2.1 23.58,35.27 23.43,35.12 IC1.2
N$13
  Top 0.61: IC1.3 22.16,34.1 21.02,34.73 18.61,34.73 R4.2
N$14
  Top 0.406: IC1.7 23.43,25.59 21.91,23.43 19.49,23.43
N$15
  pour Top: 19.37,24.19 17.84,25.72 17.21,25.72 17.21,23.3 19.37,23.3
N$16
  Top 0.406: 24.7,32.32 24.7,33.08
  Top 0.61: 24.7,33.08 25.59,33.08
  Top 0.813: 25.59,33.08 30.42,33.08
N$17
  Top 0.813: 24.83,26.48 25.21,26.1 25.21,24.32
N$18  (via drill 0.6 pad 0.61)
  other vias: 29.53,24.19
N$19
  Top 0.305: U2.7 21,9.66 Q1.1
N$20
  Top 0.305: U2.2 9.03,10.66 8.89,10.79
  Top 0.406: R12.2 6.35,11.11 | 6.35,11.11 8.57,11.11 8.89,10.79 | R11.1 5.39,12.06 6.35,11.11
N$21
  Top 0.406: Q1.3 28.54,6.95
  Top 1.016: D2.A 26.16,4.58 28.54,6.95
  Top 1.422: L1.2 25.4,12.7 28.57,9.53 28.57,7.66 Q1.3
N$22
  Top 0.406: R1.2 6.08,1.86 C7.1 12.74,1.91
  Top 1.016: D2.C 12.74,1.91
N$23
  Top 0.305: U2.3 8.89,10.16
  Top 0.406: 8.89,10.16 8.62,10.16 C6.1
N$24
  Top 0.305: U2.4 9.66,9.66 8.89,8.89
  Top 0.406: 8.89,8.89 8.89,6.99 8.26,6.35 R10.1
N$25
  Top 0.305: U2.6 19.41,9.16 20.95,7.62 20.95,5.62 Q1.2
  Top 1.016: Q1.2 18.99,5.34 R9.1
N$26
  Top 0.305: U2.9 14.11,10.66 13.97,10.79 13.97,17.78 14.61,18.41 14.61,19.36 R14.2
  Top 0.406: R13.1 R14.2
N$27
  Top 0.406: R15.2 C4.1
N$28
  Top 0.305: U2.1 10.65,11.57 10.16,12.06
  Top 0.406: 10.16,12.06 10.16,15.55 R15.1
N$29
  Top 0.305: U2.8 17.14,10.16 17.78,10.79 18.18,10.79 C8.1
N$30
  Top 0.406: 27.88,26.35 28.64,26.35 28.64,25.84
N$31
  Top 0.61: 21.53,38.16 21.53,39.31
N$32
  Top 0.61: 25.21,38.29 26.48,38.29
N$33
  Top 0.406: U3.6 48.48,12.38 Q2.1
N$34
  Top 0.406: U3.3 40.63,12.38 39.69,11.43 R7.1 38.73,8.25 R8.2
N$35
  Top 0.406: D3.A 53.15,7.47 Q2.3 55.24,10.16 53.34,12.06 53.34,17.72 L3.2
N$36
  Top 0.406: C10.1 43.13,1.59 R19.2 46.99,1.59 48.9,1.91 D3.C
N$37
  Top 0.406: U3.2 39.36,13.03 R18.1
N$38
  Top 0.406: U3.7 45.39,13.03 45.09,13.34 45.09,13.97 44.45,14.61 41.59,14.61 R6.1
N$39
  Top 0.406: 43.81,13.65 42.04,13.65 U3.1
  Top 0.61: Q2.2 47.05,7.88 46.67,8.25 | 46.67,8.25 R5.1 45.08,10.8 44.13,11.75 44.13,13.34 43.81,13.65 | C5.1 46.04,7.62 46.67,8.25
N$40  (via drill 0.6)
  other vias: 46.99,20
N$41
  Top 0.406: R18.2 35.88,14.61 C3.1
N$42
  Top 0.406: U4.5 79.69,6.4 79.69,8.89 81.77,10.84 Q3.1
N$43
  Top 0.305: 82.96,5.03 C18.2 82.87,5.03 | 87.63,2.86 R21.2 | U4.2 79.56,4.9 79.69,4.76 79.69,3.49 | 79.69,2.54 79.69,3.49 | 79.69,3.49 R20.1
  Top 0.406: 82.96,5.03 C11.2 85.72,2.86 87.63,2.86 | 79.69,3.49 82.87,3.49 82.87,5.03
N$44
  Top 0.406: R8.1 R19.1
N$45
  Top 1.016: 77.79,13.97 74.93,16.83 L5.2 73.38,16.83 Q3.3 84.14,14.92 85.09,15.24 D4.A
N$46
  Top 0.305: 87.31,9.84 87.31,9.21 R25.2
  Top 0.406: C14.1 87.63,10.16 87.31,9.84
  Top 1.016: D4.C 88.08,12.79 C14.1
N$47
  Top 0.305: U4.10 73.3,4.4
  Top 0.406: 73.3,4.4 71.44,2.54 C13.1
N$48
  Top 0.305: U4.9 70.62,4.9
  Top 0.406: 70.62,4.9 R17.1
N$49
  Top 0.305: R26.2 63.5,20.64 64.45,21.59 81.6,21.59 82.55,20.64 R16.1 82.55,17.24 Q3.2
N$50
  Top 0.305: U4.7 72.84,5.9 72.07,6.67 70.8,6.67 69.85,7.62 69.85,8.57 R22.1
  Top 0.406: R22.1 R23.2
N$51
  Top 0.305: 84.82,7.3 C11.1
  Top 0.406: R24.2 84.82,7.3
N$52
  Top 0.305: U4.3 80.6,5.4 C18.1 | 80.92,7.25 R24.1
  Top 0.406: C18.1 80.92,7.25
N$53
  Top 0.305: U4.4 77.61,5.9 77.47,6.03
  Top 0.406: C15.1 78.02,7.85 77.47,7.3 77.47,6.03
N$54
  Top 0.406: R21.1 R25.1
N$55
  Top 0.305: U4.8 72.07,5.4 71.44,6.03 63.82,6.03 62.55,7.3 62.55,12.7 63.5,13.65 63.5,15.51 C17.1 63.5,15.61 R26.1
N$56  (via drill 0.6)
  other vias: 89.22,11.43
N$57  (via drill 0.6)
  other vias: 64.45,11.43
N$58
  Top 0.61: R27.1 D5.A
N$59
  Top 0.61: R29.1 83.5,28.01 IC2.5
N$61
  Top 0.61: 91.49,36.09 D5.K 88.46,36.09 C19.1 | IC2.6 85.66,26.54 85.03,25.91 83.76,25.91 81.98,28.19 80.71,28.19 79.82,30.1 79.82,36.83 80.33,37.34 R28.1 85.22,37.08 86.17,37.08 87.03,36.22 C19.1 | C19.1 87.08,36.22 86.93,36.07 IC2.2
N$62
  Top 0.61: IC2.3 85.66,35.05 84.52,35.69 82.11,35.69 R29.2
N$63
  Top 0.406: IC2.7 86.93,26.54 85.41,24.38 83,24.38
N$64
  pour Top: 82.87,25.15 81.34,26.67 80.71,26.67 80.71,24.26 82.87,24.26
N$65
  Top 0.406: 88.2,33.27 88.2,34.04
  Top 0.61: 88.2,34.04 89.09,34.04
  Top 0.813: 89.09,34.04 93.92,34.04
N$66
  Top 0.813: 88.33,27.43 88.71,27.05 88.71,25.27
N$67  (via drill 0.6 pad 0.61)
  other vias: 93.03,25.15
N$68
  Top 0.406: 91.38,27.3 92.14,27.3 92.14,26.8
N$69
  Top 0.61: 85.03,39.12 85.03,40.26
N$70
  Top 0.61: 88.71,39.24 89.98,39.24
N$71
  Top 0.61: R30.1 D6.A
N$72
  Top 0.61: R32.1 67.63,28.01 IC3.5
N$73
  Top 0.61: 75.61,36.09 D6.K 72.58,36.09 C20.1 | IC3.6 69.79,26.54 69.15,25.91 67.88,25.91 66.1,28.19 64.83,28.19 63.94,30.1 63.94,36.83 64.45,37.34 R31.1 69.34,37.08 70.29,37.08 71.16,36.22 C20.1 | C20.1 71.21,36.22 71.06,36.07 IC3.2
N$74
  pour Top: 3.49,24.19 1.97,25.72 1.33,25.72 1.33,23.3 3.49,23.3
N$75
  Top 0.61: IC3.3 69.79,35.05 68.64,35.69 66.23,35.69 R32.2
N$76
  Top 0.406: IC3.7 71.06,26.54 69.53,24.38 67.12,24.38
N$77
  pour Top: 66.99,25.15 65.47,26.67 64.83,26.67 64.83,24.26 66.99,24.26
N$78
  Top 0.406: 72.33,33.27 72.33,34.04
  Top 0.61: 72.33,34.04 73.22,34.04
  Top 0.813: 73.22,34.04 78.04,34.04
N$79
  Top 0.813: 72.45,27.43 72.83,27.05 72.83,25.27
N$80  (via drill 0.6 pad 0.61)
  other vias: 77.15,25.15
N$81
  Top 0.406: 75.5,27.3 76.26,27.3 76.26,26.8
N$82
  Top 0.61: 69.15,39.12 69.15,40.26
N$83
  Top 0.61: 72.83,39.24 74.11,39.24
N$84
  Top 0.61: R42.1 D8.A
N$85
  Top 0.61: IC6.3 6.29,34.1 5.14,34.73 2.73,34.73 R44.2
N$86
  Top 0.61: R44.1 4.13,27.05 IC6.5
N$87
  Top 0.61: R33.1 D7.A
N$88
  Top 0.61: R35.1 51.75,27.05 IC4.5
N$89
  Top 0.61: 59.74,35.13 D7.K 56.71,35.13 C21.1 | IC4.6 53.91,25.59 53.28,24.96 52.01,24.96 50.23,27.24 48.96,27.24 48.07,29.15 48.07,35.88 48.58,36.39 R34.1 53.47,36.13 54.42,36.13 55.28,35.27 C21.1 | C21.1 55.33,35.27 55.18,35.12 IC4.2
N$90
  Top 0.61: 12.11,35.13 D8.K 9.08,35.13 C1.1 | IC6.6 6.29,25.59 5.65,24.96 4.38,24.96 2.6,27.24 1.33,27.24 0.45,29.15 0.45,35.88 0.95,36.39 R43.1 5.84,36.13 6.79,36.13 7.66,35.27 C1.1 | C1.1 7.71,35.27 7.56,35.12 IC6.2
N$91
  Top 0.813: LED2.K 36.2,52.7 33.66,55.24 LED1.A
N$92  (1 unrouted)
  Top 1.422: LED4.K 31.11,56.52 | LED3.A 36.83,55.24
N$93
  Top 0.813: T2.B 43.49,58.42 R37.1
N$94
  Top 0.813: LED3.K 41.1,52.7 T2.C
N$95
  Top 0.813: LED2.A LED4.A R38.2
N$97  (1 unrouted)
  Top 1.422: 15.88,48.9 0.1
N$98  (1 unrouted)
N$99  (1 unrouted)
N$100  (1 unrouted)
N$101  (1 unrouted)
N$102  (1 unrouted)
N$103  (1 unrouted)
N$104
  Top 0.813: LED6.K 11.43,52.07 8.89,54.61 LED5.A
N$105  (1 unrouted)
  Top 0.813: LED7.A 14.61,51.44 16.51,51.44 17.78,52.7 17.78,53.98 18.41,54.61
N$106
  Top 0.813: T3.B 19.36,58.42 R39.1
N$107  (1 unrouted)
N$108
  Top 0.813: LED8.A LED6.A 8.57,49.22 R40.2
N$109  (via drill 0.6)
  other vias: 40.01,46.35
N$110
  Top 0.813: 42.55,61.59 40.64,61.59 41.91,62.23
N$111
  Top 1.676: 34.92,41.27 arc-180 34.92,66.67
N$112
  Top 1.422: 31.11,61.59 29.84,62.87
N$113
  Top 1.422: 28.57,59.05 26.04,60.33
N$114
  Top 1.422: 26.67,55.88 24.77,55.88
N$115
  Top 1.422: 26.67,52.07 24.77,52.07
N$116
  Top 1.422: 28.57,48.9 26.04,48.9
N$117
  Top 1.422: 41.91,48.9 44.45,48.26 44.45,43.18 41.27,41.91 37.47,41.27
N$118  (via drill 0.6)
  other vias: 38.1,59.05
N$119  (via drill 0.6)
  other vias: 12.06,46.99
N$120  (via drill 0.6)
  other vias: 16.51,62.87
N$121  (via drill 0.6)
  other vias: 12.7,58.42
N$122  (via drill 0.6)
  other vias: 14.61,44.45
N$123
  Top 0.61: IC4.3 53.91,34.1 52.77,34.73 50.35,34.73 R35.2
N$124
  Top 0.406: IC4.7 55.18,25.59 53.66,23.43 51.24,23.43
N$125
  pour Top: 51.12,24.19 49.59,25.72 48.96,25.72 48.96,23.3 51.12,23.3
N$126
  Top 0.406: 56.45,32.32 56.45,33.08
  Top 0.61: 56.45,33.08 57.34,33.08
  Top 0.813: 57.34,33.08 62.17,33.08
N$127
  Top 0.813: 56.58,26.48 56.96,26.1 56.96,24.32
N$128  (via drill 0.6 pad 0.61)
  other vias: 61.28,24.19
N$129
  Top 0.406: 59.63,26.35 60.39,26.35 60.39,25.84
N$130
  Top 0.61: 53.28,38.16 53.28,39.31
N$131
  Top 0.61: 56.96,38.29 58.23,38.29
N$132
  Top 0.61: R36.1 D9.A
N$133
  Top 0.61: R45.1 35.88,27.05 IC5.5
N$134
  Top 0.61: 43.86,35.13 D9.K 40.83,35.13 C22.1 | IC5.6 38.04,25.59 37.4,24.96 36.13,24.96 34.35,27.24 33.08,27.24 32.19,29.15 32.19,35.88 32.7,36.39 R41.1 37.59,36.13 38.54,36.13 39.41,35.27 C22.1 | C22.1 39.46,35.27 39.31,35.12 IC5.2
N$135
  Top 0.61: IC5.3 38.04,34.1 36.89,34.73 34.48,34.73 R45.2
N$136
  Top 0.406: IC5.7 39.31,25.59 37.78,23.43 35.37,23.43
N$137
  pour Top: 35.24,24.19 33.72,25.72 33.08,25.72 33.08,23.3 35.24,23.3
N$138
  Top 0.406: 40.58,32.32 40.58,33.08
  Top 0.61: 40.58,33.08 41.47,33.08
  Top 0.813: 41.47,33.08 46.29,33.08
N$139
  Top 0.813: 40.7,26.48 41.08,26.1 41.08,24.32
N$140  (via drill 0.6 pad 0.61)
  other vias: 45.4,24.19
N$141
  Top 0.406: 43.75,26.35 44.51,26.35 44.51,25.84
N$142
  Top 0.61: 37.4,38.16 37.4,39.31
N$143
  Top 0.61: 41.08,38.29 42.35,38.29
N$144
  Top 0.305: U1.7 67.67,51.89 Q4.1
N$145
  Top 0.305: U1.2 55.7,52.89 55.56,53.02
  Top 0.406: R49.2 53.02,53.34 | 53.02,53.34 55.25,53.34 55.56,53.02 | R48.1 52.07,54.29 53.02,53.34
N$146
  Top 0.406: Q4.3 75.21,49.17
  Top 1.016: D10.A 72.84,46.8 75.21,49.17
  Top 1.422: L7.2 72.07,54.93 75.25,51.75 75.25,49.89 Q4.3
N$147
  Top 0.406: R53.2 52.75,44.09 C25.1 59.42,44.13
  Top 1.016: D10.C 59.42,44.13
N$148
  Top 0.305: U1.3 55.56,52.39
  Top 0.406: 55.56,52.39 55.29,52.39 C24.1
N$149
  Top 0.305: U1.4 56.33,51.89 55.56,51.12
  Top 0.406: 55.56,51.12 55.56,49.21 54.93,48.58 R47.1
N$150
  Top 0.305: U1.6 66.09,51.39 67.63,49.85 67.63,47.85 Q4.2
  Top 1.016: Q4.2 65.66,47.57 R46.1
N$151
  Top 0.305: U1.9 60.78,52.89 60.64,53.02 60.64,60.01 61.28,60.64 61.28,61.59 R51.2
  Top 0.406: R50.1 R51.2
N$152
  Top 0.406: R52.2 C23.1
N$153
  Top 0.305: U1.1 57.33,53.8 56.83,54.29
  Top 0.406: 56.83,54.29 56.83,57.78 R52.1
N$154
  Top 0.305: U1.8 63.82,52.39 64.45,53.02 64.86,53.02 C26.1
N$155
  Top 0.406: R53.1 50.48,44.13 48.58,46.04 R49.1
N$156  (via drill 0.6)
  other vias: 65.41,59.05
N$159
  Top 0.61: R54.1 D11.A
N$160
  Top 0.61: R56.1 83.5,46.1 IC7.5
N$161
  Top 0.61: 91.49,54.18 D11.K 88.46,54.18 C28.1 | IC7.6 85.66,44.64 85.03,44.01 83.76,44.01 81.98,46.29 80.71,46.29 79.82,48.2 79.82,54.93 80.33,55.44 R55.1 85.22,55.18 86.17,55.18 87.03,54.32 C28.1 | C28.1 87.08,54.32 86.93,54.17 IC7.2
N$162
  Top 0.61: IC7.3 85.66,53.15 84.52,53.78 82.11,53.78 R56.2
N$163
  Top 0.406: IC7.7 86.93,44.64 85.41,42.48 83,42.48
N$164
  pour Top: 82.87,43.24 81.34,44.77 80.71,44.77 80.71,42.35 82.87,42.35
N$165
  Top 0.406: 88.2,51.37 88.2,52.13
  Top 0.61: 88.2,52.13 89.09,52.13
  Top 0.813: 89.09,52.13 93.92,52.13
N$166
  Top 0.813: 88.33,45.53 88.71,45.15 88.71,43.37
N$167  (via drill 0.6 pad 0.61)
  other vias: 93.03,43.24
N$168
  Top 0.406: 91.38,45.4 92.14,45.4 92.14,44.9
N$169
  Top 0.61: 85.03,57.21 85.03,58.36
N$170
  Top 0.61: 88.71,57.34 89.98,57.34
(copper drawn outside any net)
  shapes: Top area x103, Top circle x7

### Text on the board
Top: sw | sw | 5 | 5 | GND | GND | 0 | 0 | 1 | A | 1 | A | 12V